# Altium schematic sheet TOP Sheet.SchDoc: Top Sheet
size A4; Date: 14/02/2018; CheckedBy: Mr. Pauwels; Author: Robbie Smedts; DrawnBy: Robbie Smedts; Engineer: Robbie Smedts; Organization: KU Leuven; DocumentNumber: 1; Revision: 2; SheetNumber: 1; SheetTotal: 5; DocumentName: Top Sheet
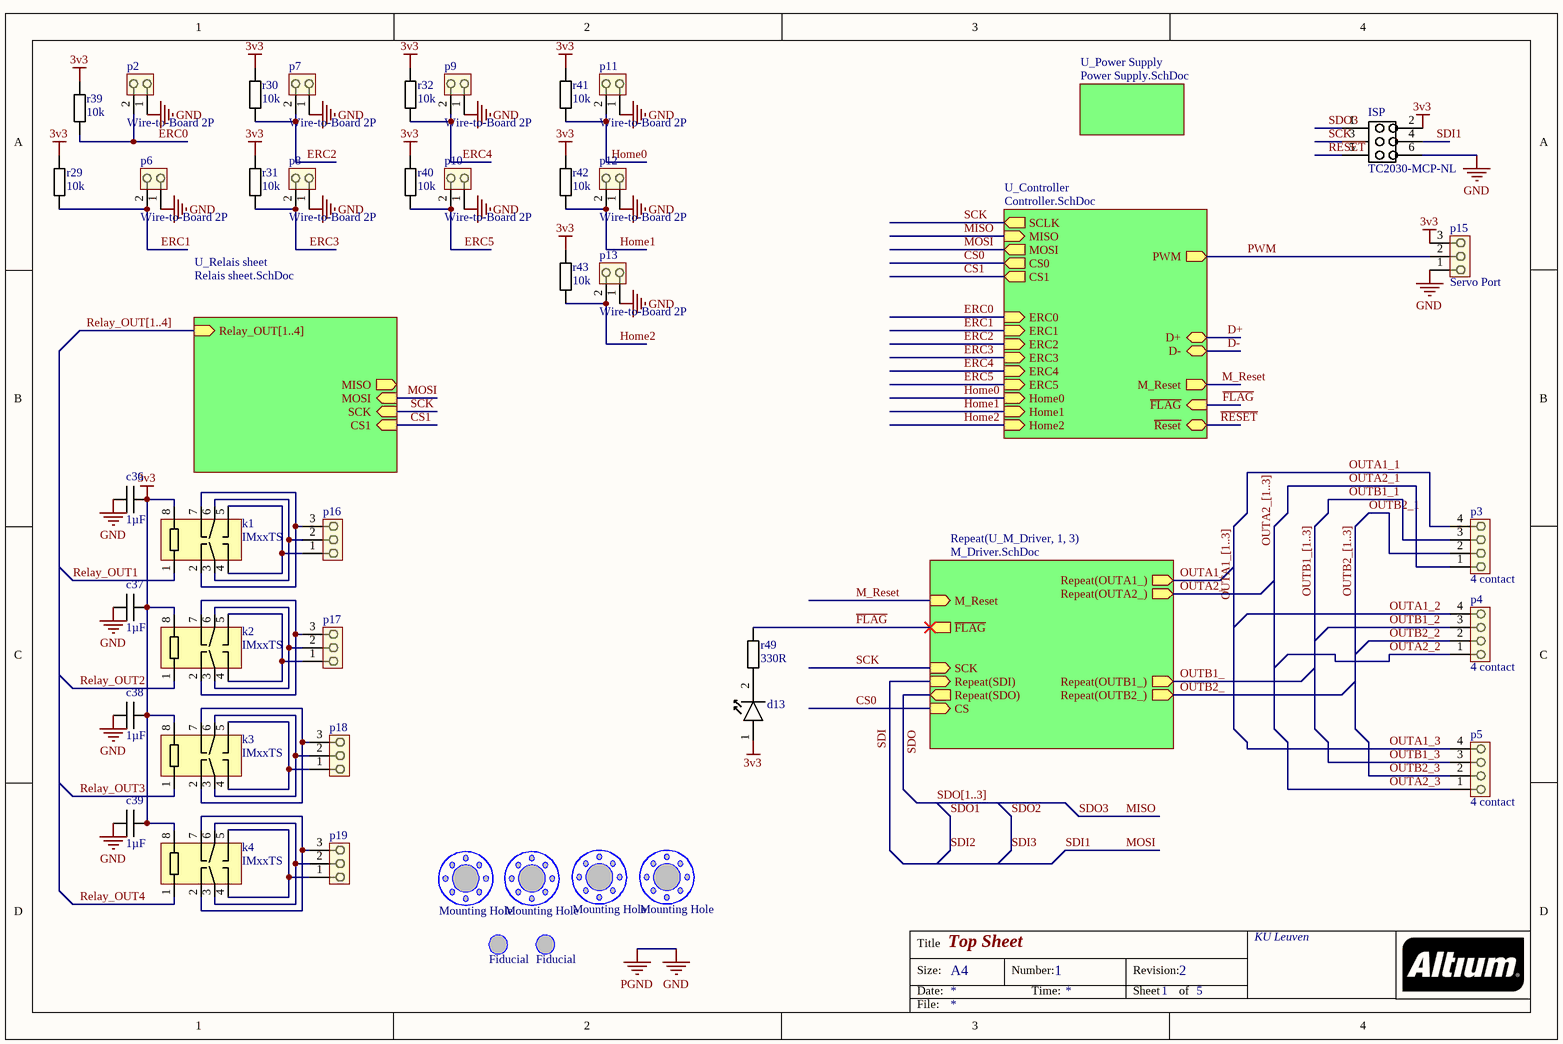
[diagram p0: TOP Sheet.SchDoc]

## Parts
c36  1µF  [0805]
c37  1µF  [0805]
c38  1µF  [0805]
c39  1µF  [0805]
d13  Yellow SMD LED  [0603 - LED]  (value not drawn)
f3  Fiducial  [Fiducial]
f4  Fiducial  [Fiducial]
H1  Mounting Hole  [Mounting Hole]
H2  Mounting Hole  [Mounting Hole]
H3  Mounting Hole  [Mounting Hole]
H4  Mounting Hole  [Mounting Hole]
ISP  TC2030-MCP-NL  [2x3-HeaderPin]
k1  IMxxTS  [THT-8]
k2  IMxxTS  [THT-8]
k3  IMxxTS  [THT-8]
k4  IMxxTS  [THT-8]
p2  Wire-to-Board 2P  [WtB-F-2p_V]
p3  4 contact  [WtB-F-4p]
p4  4 contact  [WtB-F-4p]
p5  4 contact  [WtB-F-4p]
p6  Wire-to-Board 2P  [WtB-F-2p_V]
p7  Wire-to-Board 2P  [WtB-F-2p_V]
p8  Wire-to-Board 2P  [WtB-F-2p_V]
p9  Wire-to-Board 2P  [WtB-F-2p_V]
p10  Wire-to-Board 2P  [WtB-F-2p_V]
p11  Wire-to-Board 2P  [WtB-F-2p_V]
p12  Wire-to-Board 2P  [WtB-F-2p_V]
p13  Wire-to-Board 2P  [WtB-F-2p_V]
p15  Servo Port  [1X3 Headerpin Angled]
p16  Wire-to-Board 3P  [1X3 Headerpin Angled]  (value not drawn)
p17  Wire-to-Board 3P  [1X3 Headerpin Angled]  (value not drawn)
p18  Wire-to-Board 3P  [1X3 Headerpin Angled]  (value not drawn)
p19  Wire-to-Board 3P  [1X3 Headerpin Angled]  (value not drawn)
r29  10k  [0603]
r30  10k  [0603]
r31  10k  [0603]
r32  10k  [0603]
r39  10k  [0603]
r40  10k  [0603]
r41  10k  [0603]
r42  10k  [0603]
r43  10k  [0603]
r49  330R  [0603]

## Sub-sheets
Repeat(U_M_Driver, 1, 3) = M_Driver.SchDoc: Repeat(OUTA1_) (out), Repeat(OUTA2_) (out), Repeat(OUTB1_) (out), Repeat(OUTB2_) (out), Repeat(SDO) (out), Repeat(SDI) (in), SCK (in), CS (in), ~{FLAG} (out), M_Reset (in)
U_Controller = Controller.SchDoc: MOSI (out), MISO (in), SCLK (out), CS0 (out), CS1 (out), ERC0 (in), ERC1 (in), ERC2 (in), ERC3 (in), ERC4 (in), ERC5 (in), Home0 (in), Home1 (in), Home2 (in), ~{FLAG} (in), PWM (out), ~{Reset} (bidir), D+ (bidir), D- (bidir), M_Reset (out)
U_Power Supply = Power Supply.SchDoc: no entries
U_Relais sheet = Relais sheet.SchDoc: CS1 (in), MOSI (in), MISO (out), SCK (in), Relay_OUT[1..4] (in)

## Nets
3v3: c36.2 c37.2 c38.2 c39.2 d13.1(Anode) ISP.2 k1.8 k2.8 k3.8 k4.8 p15.3 r29.2 r30.2 r31.2 r32.2 r39.2 r40.2 r41.2 r42.2 r43.2
GND: c36.1 c37.1 c38.1 c39.1 ISP.6 p2.1 p6.1 p7.1 p8.1 p9.1 p10.1 p11.1 p12.1 p13.1 p15.1  [also labelled PGND]
CS0: sheet Repeat(U_M_Driver, 1, 3)/CS, sheet U_Controller/CS0
CS1: sheet U_Relais sheet/CS1, sheet U_Controller/CS1
D+: sheet U_Controller/D+
D-: sheet U_Controller/D-
ERC0: p2.2 r39.1 ; sheet U_Controller/ERC0
ERC1: p6.2 r29.1 ; sheet U_Controller/ERC1
ERC2: p7.2 r30.1 ; sheet U_Controller/ERC2
ERC3: p8.2 r31.1 ; sheet U_Controller/ERC3
ERC4: p9.2 r32.1 ; sheet U_Controller/ERC4
ERC5: p10.2 r40.1 ; sheet U_Controller/ERC5
~{FLAG}: r49.2 ; sheet Repeat(U_M_Driver, 1, 3)/~{FLAG}, sheet U_Controller/~{FLAG}
Home0: p11.2 r41.1 ; sheet U_Controller/Home0
Home1: p12.2 r42.1 ; sheet U_Controller/Home1
Home2: p13.2 r43.1 ; sheet U_Controller/Home2
M_Reset: sheet Repeat(U_M_Driver, 1, 3)/M_Reset, sheet U_Controller/M_Reset
MISO: ISP.1 ; sheet U_Controller/MISO  [also labelled SDO3]
MOSI: ISP.4 ; sheet U_Relais sheet/MOSI, sheet U_Controller/MOSI  [also labelled SDI1]
OUTA1_: sheet Repeat(U_M_Driver, 1, 3)/Repeat(OUTA1_)
OUTA1_1: p3.4
OUTA1_2: p4.4
OUTA1_3: p5.4
OUTA2_: sheet Repeat(U_M_Driver, 1, 3)/Repeat(OUTA2_)
OUTA2_1: p3.1
OUTA2_2: p4.1
OUTA2_3: p5.1
OUTB1_: sheet Repeat(U_M_Driver, 1, 3)/Repeat(OUTB1_)
OUTB1_1: p3.3
OUTB1_2: p4.3
OUTB1_3: p5.3
OUTB2_: sheet Repeat(U_M_Driver, 1, 3)/Repeat(OUTB2_)
OUTB2_1: p3.2
OUTB2_2: p4.2
OUTB2_3: p5.2
PWM: p15.2 ; sheet U_Controller/PWM
~{RESET}: ISP.5 ; sheet U_Controller/~{Reset}
Relay_OUT1: k1.1
Relay_OUT2: k2.1
Relay_OUT3: k3.1
Relay_OUT4: k4.1
SCK: ISP.3 ; sheet Repeat(U_M_Driver, 1, 3)/SCK, sheet U_Relais sheet/SCK, sheet U_Controller/SCLK
SDI: sheet Repeat(U_M_Driver, 1, 3)/Repeat(SDI)
SDO: sheet Repeat(U_M_Driver, 1, 3)/Repeat(SDO)
Netd13_2: d13.2(Kathode) r49.1
Netk1_2: k1.2 k1.7 p16.3
Netk1_3: k1.3 k1.6 p16.2
Netk1_4: k1.4 k1.5 p16.1
Netk2_2: k2.2 k2.7 p17.3
Netk2_3: k2.3 k2.6 p17.2
Netk2_4: k2.4 k2.5 p17.1
Netk3_2: k3.2 k3.7 p18.3
Netk3_3: k3.3 k3.6 p18.2
Netk3_4: k3.4 k3.5 p18.1
Netk4_2: k4.2 k4.7 p19.3
Netk4_3: k4.3 k4.6 p19.2
Netk4_4: k4.4 k4.5 p19.1

## Buses and harness runs
bus OUTA1_[1..3]
bus OUTA2_[1..3]
bus OUTB1_[1..3]
bus OUTB2_[1..3]
bus Relay_OUT[1..4] = sheet U_Relais sheet/Relay_OUT[1..4]
bus SDO[1..3]

## Notes on the sheet
- Title
- Size:
- Date:
- A4
- Number:
- Time:
- Revision:
- Sheet
- of
- File:

## Library data of the parts
c36-c39 = 0805 Capacitor: ...F
d13 = Yellow SMD LED: 0603 Package
ISP = 2x3 Header: Header Pin
k1-k4 = IMxxTS: Standard THT Package
p3-p5 = Wire-to-Board connector 4 contacts: Wire-to-Board connector
p15 = Wire-to-Board 3 Pin
r29-r32 r39-r43 r49 = 0603 Resistor: ...R